# Altium project TX_Board.PrjPcb (part 2 of 5)
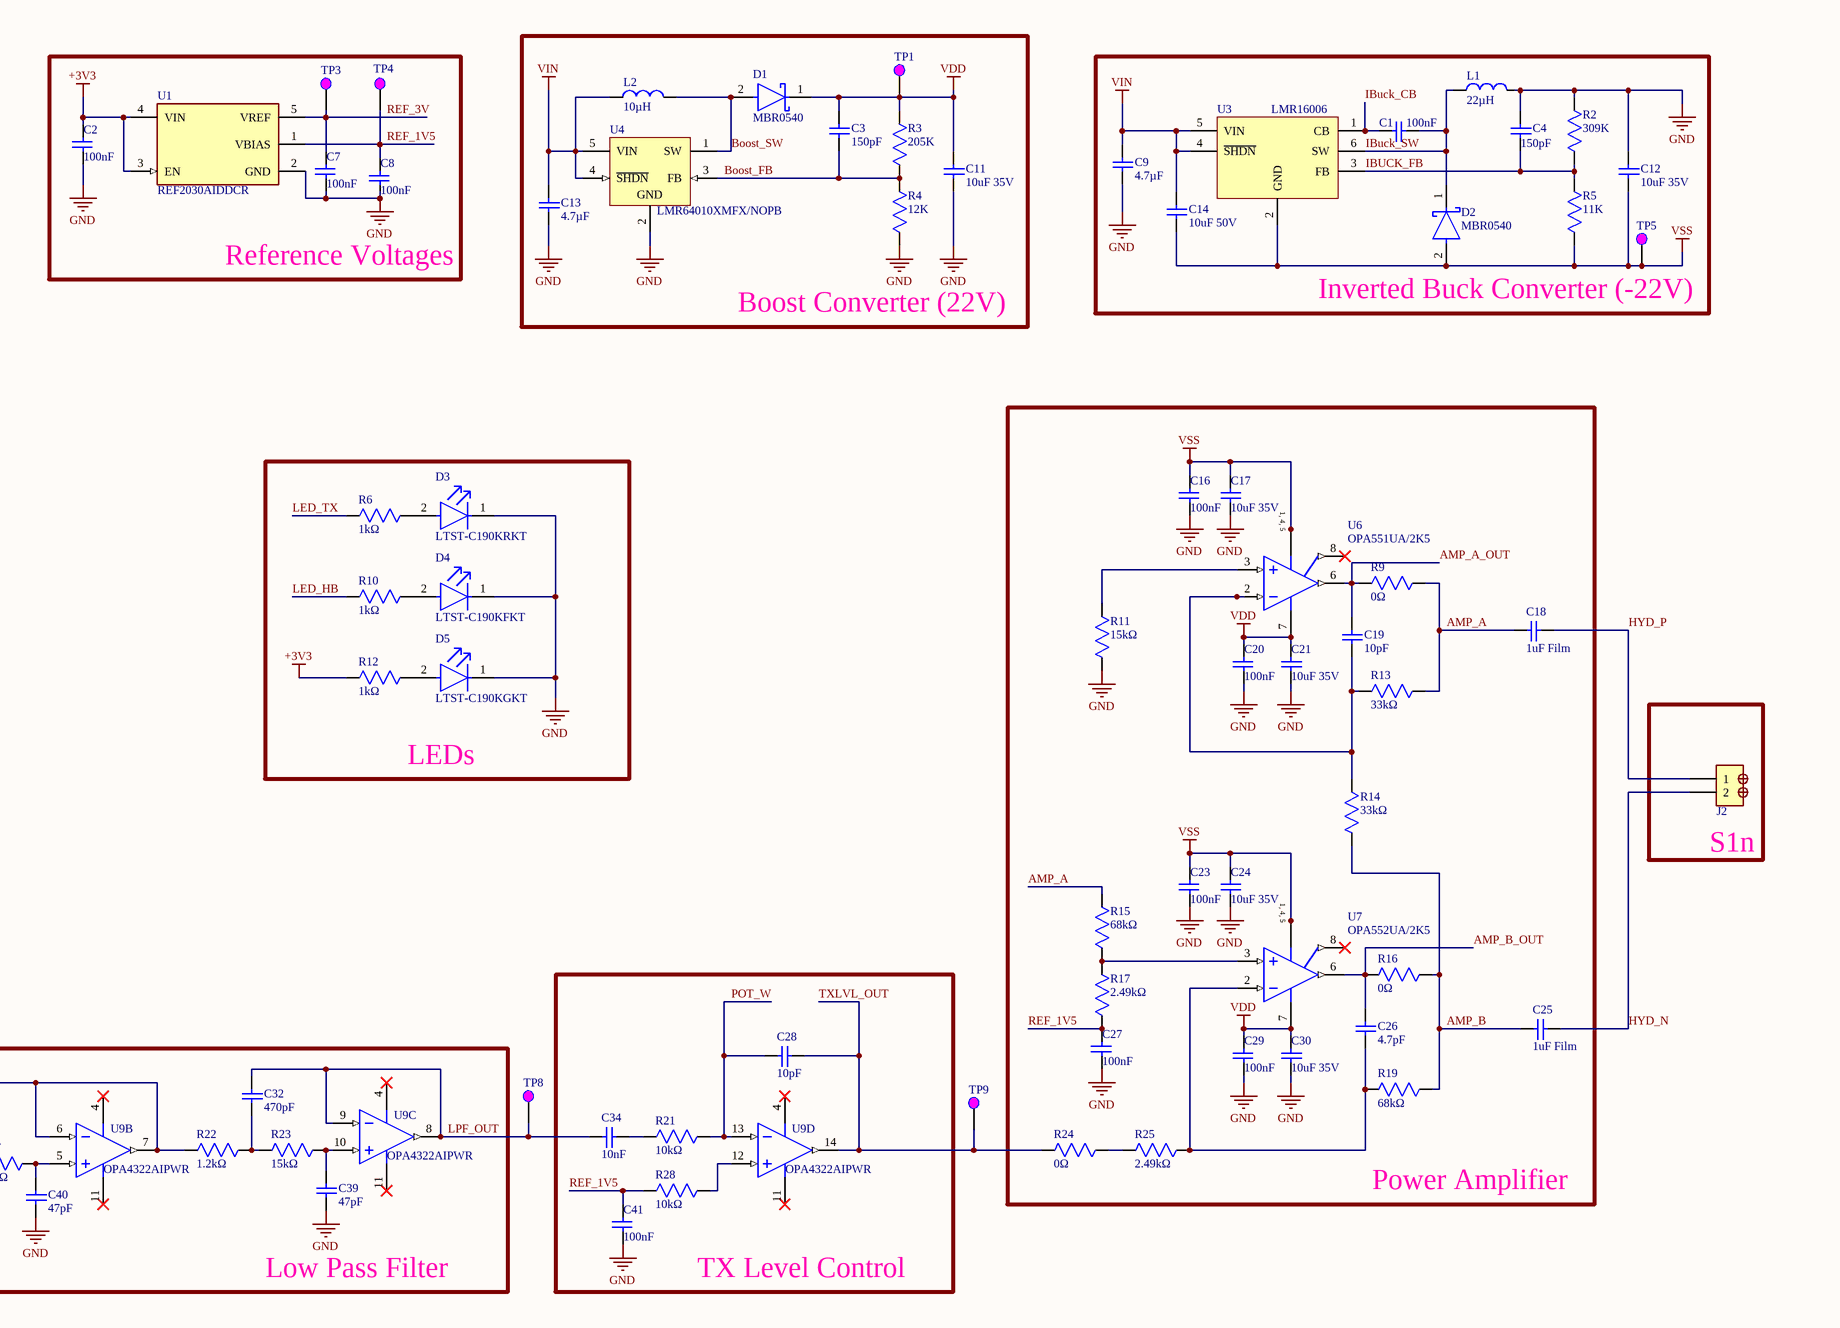
[diagram p2: TX_Board.SchDoc, right]

## Sheet TX_Board.SchDoc (continued)
### Library data of the parts
C1 C2 C6-C8 C15 C16 C20 C23 C27 C29 C31 C35 C38 C41 = CC0603KRX7R9BB104: Multilayer Ceramic Capacitor, CC Series, 0.1 - F, - 10%, X7R, 50 V, 0603 [1608 Metric]; Manufacturer: Yageo Group; Voltage: 50V; Supplier: Avnet; Supplier Part Number: CC0603KRX7R9BB104; Manufacturer Part Number: CC0603KRX7R9BB104; RoHS: Compliant; Category: Ceramic Capacitors; Stock: 6088000; Pricing: 4000=0.00582, 8000=0.00559, 16000=0.00541, 32000=0.00522, 64000=0.00504 (USD); Value: 100nF; Case/Package: 0603; Case Code (Imperial): 0603; Case Code (Metric): 1608; China RoHS: Compliant; Country of Origin: Mainland China, Taiwan; Depth: 800µm; Dielectric: X7R; Dielectric Material: Ceramic; Export Control Classification Number (ECCN) Code: EAR99; Halogen Free: Halogen Free; Height: 800µm; Harmonized Tariff Schedule (HTS) Code: 8532.24.00.20; Introduction Date: 2005-08-18; Lead Free: Lead Free; Length: 1.6mm; Lifecycle Status: Production; Material: Ceramic; Max Operating Temperature: 125°C; Min Operating Temperature: -55°C; Mounting Technology: Surface Mount; Pins: 2; Number of Terminals: 2; Radiation Hardening: No; REACH SVHC: Yes; Schedule B: 8532240020, 8532240020|8532240020, 8532240020|8532240020|8532240020, 8532240020|8532240020|8532240020|8532240020; Termination: SMD/SMT; Thickness: 889µm; Tolerance: 10%; Voltage Rating: 50V; Voltage Rating (DC): 50V; Width: 800µm; ComponentLink1URL: https://datasheet.octopart.com:443/CC0603KRX7R9BB104-Yageo-datasheet-177165144.pdf?src-supplier=IHS; ComponentLink1Description: https://datasheet.octopart.com:443/CC0603KRX7R9BB104-Yageo-datasheet-177165144.pdf?src-supplier=IHS; ComponentLink2URL: https://datasheet.octopart.com:443/CC0603KRX7R9BB104-Yageo-datasheet-82288757.pdf?src-supplier=Upverter; ComponentLink2Description: https://datasheet.octopart.com:443/CC0603KRX7R9BB104-Yageo-datasheet-82288757.pdf?src-supplier=Upverter; ComponentLink3URL: https://datasheet.octopart.com:443/CC0603KRX7R9BB104-Yageo-datasheet-68298032.pdf?src-supplier=Upverter; ComponentLink3Description: https://datasheet.octopart.com:443/CC0603KRX7R9BB104-Yageo-datasheet-68298032.pdf?src-supplier=Upverter; ComponentLink4URL: https://datasheet.octopart.com:443/CC0603KRX7R9BB104-Yageo-Group-datasheet-189192896.pdf?src-supplier=Future+Electronics; ComponentLink4Description: https://datasheet.octopart.com:443/CC0603KRX7R9BB104-Yageo-Group-datasheet-189192896.pdf?src-supplier=Future+Electronics; ComponentLink5URL: https://datasheet.octopart.com:443/CC0603KRX7R9BB104-Yageo-datasheet-12526321.pdf?src-supplier=Future+Electronics; ComponentLink5Description: https://datasheet.octopart.com:443/CC0603KRX7R9BB104-Yageo-datasheet-12526321.pdf?src-supplier=Future+Electronics; ComponentLink6URL: https://datasheet.octopart.com:443/CC0603KRX7R9BB104-Yageo-datasheet-166511530.pdf?src-supplier=Future+Electronics; ComponentLink6Description: https://datasheet.octopart.com:443/CC0603KRX7R9BB104-Yageo-datasheet-166511530.pdf?src-supplier=Future+Electronics; ComponentLink7URL: https://datasheet.octopart.com:443/CC0603KRX7R9BB104-Yageo-datasheet-137700082.pdf?src-supplier=Future+Electronics; ComponentLink7Description: https://datasheet.octopart.com:443/CC0603KRX7R9BB104-Yageo-datasheet-137700082.pdf?src-supplier=Future+Electronics; ComponentLink8URL: https://datasheet.octopart.com:443/CC0603KRX7R9BB104-Yageo-datasheet-137700084.pdf?src-supplier=Future+Electronics; ComponentLink8Description: https://datasheet.octopart.com:443/CC0603KRX7R9BB104-Yageo-datasheet-137700084.pdf?src-supplier=Future+Electronics; ComponentLink9URL: https://datasheet.octopart.com:443/CC0603KRX7R9BB104-Yageo-datasheet-27626582.pdf?src-supplier=Future+Electronics; ComponentLink9Description: https://datasheet.octopart.com:443/CC0603KRX7R9BB104-Yageo-datasheet-27626582.pdf?src-supplier=Future+Electronics; ComponentLink10URL: https://datasheet.octopart.com:443/CC0603KRX7R9BB104-Yageo-datasheet-15895757.pdf?src-supplier=Future+Electronics; ComponentLink10Description: https://datasheet.octopart.com:443/CC0603KRX7R9BB104-Yageo-datasheet-15895757.pdf?src-supplier=Future+Electronics; ComponentLink11URL: https://datasheet.octopart.com:443/CC0603KRX7R9BB104-Yageo-datasheet-8324192.pdf?src-supplier=Future+Electronics; ComponentLink11Description: https://datasheet.octopart.com:443/CC0603KRX7R9BB104-Yageo-datasheet-8324192.pdf?src-supplier=Future+Electronics; ComponentLink12URL: https://datasheet.octopart.com/CC0603KRX7R9BB104-Yageo-datasheet-10883670.pdf; ComponentLink12Description: https://datasheet.octopart.com/CC0603KRX7R9BB104-Yageo-datasheet-10883670.pdf; ComponentLink13URL: https://datasheet.octopart.com:443/CC0603KRX7R9BB104-Yageo-datasheet-181968726.pdf?src-supplier=Newark; ComponentLink13Description: https://datasheet.octopart.com:443/CC0603KRX7R9BB104-Yageo-datasheet-181968726.pdf?src-supplier=Newark; ComponentLink14URL: https://datasheet.octopart.com:443/CC0603KRX7R9BB104-Yageo-datasheet-499490.pdf?src-supplier=Newark; ComponentLink14Description: https://datasheet.octopart.com:443/CC0603KRX7R9BB104-Yageo-datasheet-499490.pdf?src-supplier=Newark; ComponentLink15URL: https://datasheet.octopart.com:443/CC0603KRX7R9BB104-Yageo-datasheet-62336348.pdf?src-supplier=Newark; ComponentLink15Description: https://datasheet.octopart.com:443/CC0603KRX7R9BB104-Yageo-datasheet-62336348.pdf?src-supplier=Newark; ComponentLink16URL: https://datasheet.octopart.com:443/CC0603KRX7R9BB104-Yageo-datasheet-147453679.pdf?src-supplier=Newark; ComponentLink16Description: https://datasheet.octopart.com:443/CC0603KRX7R9BB104-Yageo-datasheet-147453679.pdf?src-supplier=Newark; ComponentLink17URL: https://datasheet.octopart.com:443/CC0603KRX7R9BB104-Yageo-datasheet-151948686.pdf?src-supplier=Farnell; ComponentLink17Description: https://datasheet.octopart.com:443/CC0603KRX7R9BB104-Yageo-datasheet-151948686.pdf?src-supplier=Farnell; ComponentLink18URL: https://datasheet.octopart.com:443/CC0603KRX7R9BB104-Yageo-datasheet-500777.pdf?src-supplier=Farnell; ComponentLink18Description: https://datasheet.octopart.com:443/CC0603KRX7R9BB104-Yageo-datasheet-500777.pdf?src-supplier=Farnell; ComponentLink19URL: https://datasheet.octopart.com:443/CC0603KRX7R9BB104-Yageo-datasheet-178019014.pdf?src-supplier=Burklin+Elektronik; ComponentLink19Description: https://datasheet.octopart.com:443/CC0603KRX7R9BB104-Yageo-datasheet-178019014.pdf?src-supplier=Burklin+Elektronik; ComponentLink20URL: https://datasheet.octopart.com:443/CC0603KRX7R9BB104-Yageo-Group-datasheet-165992755.pdf?src-supplier=ODG+(Origin+Data+Global); ComponentLink20Description: https://datasheet.octopart.com:443/CC0603KRX7R9BB104-Yageo-Group-datasheet-165992755.pdf?src-supplier=ODG+(Origin+Data+Global); ComponentLink21URL: https://datasheet.octopart.com:443/CC0603KRX7R9BB104-Yageo-datasheet-140260305.pdf?src-supplier=SOS+electronic; ComponentLink21Description: https://datasheet.octopart.com:443/CC0603KRX7R9BB104-Yageo-datasheet-140260305.pdf?src-supplier=SOS+electronic; ComponentLink22URL: https://datasheet.octopart.com:443/CC0603KRX7R9BB104-Yageo-datasheet-120101875.pdf?src-supplier=Megastar; ComponentLink22Description: https://datasheet.octopart.com:443/CC0603KRX7R9BB104-Yageo-datasheet-120101875.pdf?src-supplier=Megastar; ComponentLink23URL: https://datasheet.octopart.com:443/CC0603KRX7R9BB104-Yageo-datasheet-8701427.pdf?src-supplier=element14; ComponentLink23Description: https://datasheet.octopart.com:443/CC0603KRX7R9BB104-Yageo-datasheet-8701427.pdf?src-supplier=element14; ComponentLink24URL: https://datasheet.octopart.com:443/CC0603KRX7R9BB104-Yageo-datasheet-5301394.pdf?src-supplier=element14; ComponentLink24Description: https://datasheet.octopart.com:443/CC0603KRX7R9BB104-Yageo-datasheet-5301394.pdf?src-supplier=element14; ComponentLink25URL: https://datasheet.octopart.com:443/CC0603KRX7R9BB104-Yageo-datasheet-17600895.pdf?src-supplier=TME; ComponentLink25Description: https://datasheet.octopart.com:443/CC0603KRX7R9BB104-Yageo-datasheet-17600895.pdf?src-supplier=TME; ComponentLink26URL: http://sigma.octopart.com:80/15889575/rohs_statement/Yageo-CC0603KRX7R9BB104.pdf?src-supplier=Compliance+Statements; ComponentLink26Description: http://sigma.octopart.com:80/15889575/rohs_statement/Yageo-CC0603KRX7R9BB104.pdf?src-supplier=Compliance+Statements; ComponentLink27URL: http://sigma.octopart.com:80/conflict_mineral_statement/Yageo-company-3.pdf?src-supplier=Compliance+Statements; ComponentLink27Description: http://sigma.octopart.com:80/conflict_mineral_statement/Yageo-company-3.pdf?src-supplier=Compliance+Statements; JLCPCB Part Number: C14663
C3 C4 = CC0603JRNPO9BN151: Surface Mount Ceramic Multilayer Capacitor 150pF 5% C0G 50V 0603 Paper T/R; Manufacturer: Yageo Group; Insulation Resistance: 100GΩ; Temperature Coefficient: 30ppm/°C; Supplier: Avnet; Supplier Part Number: CC0603JRNPO9BN151; Manufacturer Part Number: CC0603JRNPO9BN151; RoHS: Compliant; Category: Ceramic Capacitors; Stock: 168000; Pricing: 4000=0.00694 (USD); Value: 150pF; Case/Package: 0603; Case Code (Imperial): 0603; Case Code (Metric): 1608; China RoHS: Compliant; Composition: Ceramic; Country of Origin: Mainland China, Taiwan; Depth: 800µm; Dielectric: C0G; Dielectric Material: Ceramic; Export Control Classification Number (ECCN) Code: EAR99; Halogen Free: Halogen Free; Height: 800µm; Harmonized Tariff Schedule (HTS) Code: 8532.24.00.20; Introduction Date: 2005-07-07; Lead Free: Lead Free; Length: 1.6mm; Lifecycle Status: Production; Material: Ceramic; Max Operating Temperature: 125°C; Min Operating Temperature: -55°C; Mounting Technology: Surface Mount; Pins: 2; Number of Terminals: 2; Radiation Hardening: No; REACH SVHC: Unaffected; Termination: SMD/SMT; Thickness: 889µm; Tolerance: 5%; Voltage: 50V; Voltage Rating: 50V; Voltage Rating (AC): 50V; Voltage Rating (DC): 50V; Width: 800µm; ComponentLink1URL: https://datasheet.octopart.com:443/CC0603JRNPO9BN151-Yageo-datasheet-182140217.pdf?src-supplier=IHS; ComponentLink1Description: https://datasheet.octopart.com:443/CC0603JRNPO9BN151-Yageo-datasheet-182140217.pdf?src-supplier=IHS; ComponentLink2URL: https://datasheet.octopart.com:443/CC0603JRNPO9BN151-Yageo-datasheet-10406438.pdf?src-supplier=element14+APAC; ComponentLink2Description: https://datasheet.octopart.com:443/CC0603JRNPO9BN151-Yageo-datasheet-10406438.pdf?src-supplier=element14+APAC; ComponentLink3URL: https://datasheet.octopart.com:443/CC0603JRNPO9BN151-Yageo-datasheet-65873193.pdf?src-supplier=element14+APAC; ComponentLink3Description: https://datasheet.octopart.com:443/CC0603JRNPO9BN151-Yageo-datasheet-65873193.pdf?src-supplier=element14+APAC; ComponentLink4URL: https://datasheet.octopart.com:443/CC0603JRNPO9BN151-Yageo-datasheet-10882999.pdf?src-supplier=element14+APAC; ComponentLink4Description: https://datasheet.octopart.com:443/CC0603JRNPO9BN151-Yageo-datasheet-10882999.pdf?src-supplier=element14+APAC; ComponentLink5URL: https://datasheet.octopart.com:443/CC0603JRNPO9BN151-Yageo-datasheet-5321569.pdf?src-supplier=Newark; ComponentLink5Description: https://datasheet.octopart.com:443/CC0603JRNPO9BN151-Yageo-datasheet-5321569.pdf?src-supplier=Newark; ComponentLink6URL: https://datasheet.octopart.com:443/CC0603JRNPO9BN151-Yageo-datasheet-181968183.pdf?src-supplier=Newark; ComponentLink6Description: https://datasheet.octopart.com:443/CC0603JRNPO9BN151-Yageo-datasheet-181968183.pdf?src-supplier=Newark; ComponentLink7URL: https://datasheet.octopart.com:443/CC0603JRNPO9BN151-Yageo-datasheet-181968182.pdf?src-supplier=Newark; ComponentLink7Description: https://datasheet.octopart.com:443/CC0603JRNPO9BN151-Yageo-datasheet-181968182.pdf?src-supplier=Newark; ComponentLink8URL: https://datasheet.octopart.com:443/CC0603JRNPO9BN151-Yageo-datasheet-151948684.pdf?src-supplier=Newark; ComponentLink8Description: https://datasheet.octopart.com:443/CC0603JRNPO9BN151-Yageo-datasheet-151948684.pdf?src-supplier=Newark; ComponentLink9URL: https://datasheet.octopart.com:443/CC0603JRNPO9BN151-Yageo-datasheet-67645495.pdf?src-supplier=Newark; ComponentLink9Description: https://datasheet.octopart.com:443/CC0603JRNPO9BN151-Yageo-datasheet-67645495.pdf?src-supplier=Newark; ComponentLink10URL: https://datasheet.octopart.com:443/CC0603JRNPO9BN151-Yageo-datasheet-137875056.pdf?src-supplier=Future+Electronics; ComponentLink10Description: https://datasheet.octopart.com:443/CC0603JRNPO9BN151-Yageo-datasheet-137875056.pdf?src-supplier=Future+Electronics; ComponentLink11URL: https://datasheet.octopart.com:443/CC0603JRNPO9BN151-Yageo-datasheet-136957424.pdf?src-supplier=Future+Electronics; ComponentLink11Description: https://datasheet.octopart.com:443/CC0603JRNPO9BN151-Yageo-datasheet-136957424.pdf?src-supplier=Future+Electronics; ComponentLink12URL: https://datasheet.octopart.com:443/CC0603JRNPO9BN151-Yageo-datasheet-137700082.pdf?src-supplier=Future+Electronics; ComponentLink12Description: https://datasheet.octopart.com:443/CC0603JRNPO9BN151-Yageo-datasheet-137700082.pdf?src-supplier=Future+Electronics; ComponentLink13URL: https://datasheet.octopart.com:443/CC0603JRNPO9BN151-Yageo-datasheet-78855684.pdf?src-supplier=Future+Electronics; ComponentLink13Description: https://datasheet.octopart.com:443/CC0603JRNPO9BN151-Yageo-datasheet-78855684.pdf?src-supplier=Future+Electronics; ComponentLink14URL: https://datasheet.octopart.com:443/CC0603JRNPO9BN151-Yageo-datasheet-62091628.pdf?src-supplier=Future+Electronics; ComponentLink14Description: https://datasheet.octopart.com:443/CC0603JRNPO9BN151-Yageo-datasheet-62091628.pdf?src-supplier=Future+Electronics; ComponentLink15URL: https://datasheet.octopart.com:443/CC0603JRNPO9BN151-Yageo-datasheet-24578986.pdf?src-supplier=Future+Electronics; ComponentLink15Description: https://datasheet.octopart.com:443/CC0603JRNPO9BN151-Yageo-datasheet-24578986.pdf?src-supplier=Future+Electronics; ComponentLink16URL: https://datasheet.octopart.com:443/CC0603JRNPO9BN151-Yageo-datasheet-16730043.pdf?src-supplier=Future+Electronics; ComponentLink16Description: https://datasheet.octopart.com:443/CC0603JRNPO9BN151-Yageo-datasheet-16730043.pdf?src-supplier=Future+Electronics; ComponentLink17URL: https://datasheet.octopart.com:443/CC0603JRNPO9BN151-Yageo-datasheet-15895757.pdf?src-supplier=Future+Electronics; ComponentLink17Description: https://datasheet.octopart.com:443/CC0603JRNPO9BN151-Yageo-datasheet-15895757.pdf?src-supplier=Future+Electronics; ComponentLink18URL: https://datasheet.octopart.com:443/CC0603JRNPO9BN151-Yageo-datasheet-12589826.pdf?src-supplier=Future+Electronics; ComponentLink18Description: https://datasheet.octopart.com:443/CC0603JRNPO9BN151-Yageo-datasheet-12589826.pdf?src-supplier=Future+Electronics; ComponentLink19URL: https://datasheet.octopart.com:443/CC0603JRNPO9BN151-Yageo-datasheet-8817079.pdf?src-supplier=element14; ComponentLink19Description: https://datasheet.octopart.com:443/CC0603JRNPO9BN151-Yageo-datasheet-8817079.pdf?src-supplier=element14; ComponentLink20URL: https://datasheet.octopart.com:443/CC0603JRNPO9BN151-Yageo-datasheet-8324240.pdf?src-supplier=element14; ComponentLink20Description: https://datasheet.octopart.com:443/CC0603JRNPO9BN151-Yageo-datasheet-8324240.pdf?src-supplier=element14; ComponentLink21URL: https://datasheet.octopart.com:443/CC0603JRNPO9BN151-Yageo-datasheet-504625.pdf?src-supplier=element14; ComponentLink21Description: https://datasheet.octopart.com:443/CC0603JRNPO9BN151-Yageo-datasheet-504625.pdf?src-supplier=element14; ComponentLink22URL: https://datasheet.octopart.com:443/CC0603JRNPO9BN151-Yageo-Group-datasheet-188129580.pdf?src-supplier=LCSC; ComponentLink22Description: https://datasheet.octopart.com:443/CC0603JRNPO9BN151-Yageo-Group-datasheet-188129580.pdf?src-supplier=LCSC; ComponentLink23URL: https://datasheet.octopart.com:443/CC0603JRNPO9BN151-Yageo-datasheet-10621397.pdf?src-supplier=Farnell; ComponentLink23Description: https://datasheet.octopart.com:443/CC0603JRNPO9BN151-Yageo-datasheet-10621397.pdf?src-supplier=Farnell; ComponentLink24URL: https://datasheet.octopart.com:443/CC0603JRNPO9BN151-Yageo-datasheet-8643175.pdf?src-supplier=SOS+electronic; ComponentLink24Description: https://datasheet.octopart.com:443/CC0603JRNPO9BN151-Yageo-datasheet-8643175.pdf?src-supplier=SOS+electronic; ComponentLink25URL: https://datasheet.octopart.com:443/CC0603JRNPO9BN151-Yageo-datasheet-68296204.pdf?src-supplier=Megastar; ComponentLink25Description: https://datasheet.octopart.com:443/CC0603JRNPO9BN151-Yageo-datasheet-68296204.pdf?src-supplier=Megastar; ComponentLink26URL: http://sigma.octopart.com:80/conflict_mineral_statement/Yageo-company-3.pdf?src-supplier=Compliance+Statements; ComponentLink26Description: http://sigma.octopart.com:80/conflict_mineral_statement/Yageo-company-3.pdf?src-supplier=Compliance+Statements; ComponentLink27URL: http://sigma.octopart.com:80/rohs_statement/Yageo-company-2.pdf?src-supplier=Compliance+Statements; ComponentLink27Description: http://sigma.octopart.com:80/rohs_statement/Yageo-company-2.pdf?src-supplier=Compliance+Statements; JLCPCB Part Number: C107038
C5 C37 = CL10A106MA8NRNC: 25V 10uF X5R ±20% 0603 Multilayer Ceramic Capacitors MLCC - SMD/SMT ROHS; Manufacturer: Samsung Electro-Mechanics; Value: 10µF; Supplier: Avnet; Supplier Part Number: CL10A106MA8NRNC; Manufacturer Part Number: CL10A106MA8NRNC; RoHS: Compliant; Category: Ceramic Capacitors; Stock: 6860000; Pricing: 4000=0.03585, 8000=0.03513, 16000=0.03443, 32000=0.03377, 64000=0.03313 (USD); Case/Package: 0603; Case Code (Imperial): 0603; Case Code (Metric): 1608; China RoHS: Compliant; Contact Plating: Tin; Country of Origin: Mainland China, Philippines, South Korea; Dielectric: X5R; Dielectric Material: Ceramic; Export Control Classification Number (ECCN) Code: EAR99; Height: 800µm; Harmonized Tariff Schedule (HTS) Code: 8532.24.00.20; Introduction Date: 2013-01-16; Lead Free: Lead Free; Length: 1.6mm; Lifecycle Status: Production; Material: Ceramic; Max Operating Temperature: 85°C; Min Operating Temperature: -55°C; Mounting Technology: Surface Mount; Number of Terminals: 2; Packaging: Tape & Reel (TR); REACH SVHC: Yes; Schedule B: 8532240020, 8532240020|8532240020|8532240020|8532240020|8532240020|8532240020|8532240020|8532240020|8532240020|8532240020|8532240020, 8532240020|8532240020|8532240020|8532240020|8532240020|8532240020|8532240020|8532240020|8532240020|8532240020|8532240020|8532240020, 8532240020|8532240020|8532240020|8532240020|8532240020|8532240020|8532240020|8532240020|8532240020|8532240020|8532240020|8532240020|8532240020; Termination: Wraparound; Thickness: 889µm; Tolerance: 20%; Voltage Rating: 25V; Voltage Rating (DC): 25V; Width: 800µm; ComponentLink1URL: https://datasheet.octopart.com:443/CL10A106MA8NRNC-Samsung-Electro-Mechanics-datasheet-182019172.pdf?src-supplier=IHS; ComponentLink1Description: https://datasheet.octopart.com:443/CL10A106MA8NRNC-Samsung-Electro-Mechanics-datasheet-182019172.pdf?src-supplier=IHS; ComponentLink2URL: https://datasheet.octopart.com:443/CL10A106MA8NRNC-Samsung-Electro-Mechanics-datasheet-137745063.pdf?src-supplier=Future+Electronics; ComponentLink2Description: https://datasheet.octopart.com:443/CL10A106MA8NRNC-Samsung-Electro-Mechanics-datasheet-137745063.pdf?src-supplier=Future+Electronics; ComponentLink3URL: https://datasheet.octopart.com:443/CL10A106MA8NRNC-Samsung-Electro-Mechanics-datasheet-136031756.pdf?src-supplier=Future+Electronics; ComponentLink3Description: https://datasheet.octopart.com:443/CL10A106MA8NRNC-Samsung-Electro-Mechanics-datasheet-136031756.pdf?src-supplier=Future+Electronics; ComponentLink4URL: https://datasheet.octopart.com:443/CL10A106MA8NRNC-Samsung-Electro-Mechanics-datasheet-110226291.pdf?src-supplier=Future+Electronics; ComponentLink4Description: https://datasheet.octopart.com:443/CL10A106MA8NRNC-Samsung-Electro-Mechanics-datasheet-110226291.pdf?src-supplier=Future+Electronics; ComponentLink5URL: https://datasheet.octopart.com:443/CL10A106MA8NRNC-Samsung-Electro-Mechanics-datasheet-87580073.pdf?src-supplier=Future+Electronics; ComponentLink5Description: https://datasheet.octopart.com:443/CL10A106MA8NRNC-Samsung-Electro-Mechanics-datasheet-87580073.pdf?src-supplier=Future+Electronics; ComponentLink6URL: https://datasheet.octopart.com:443/CL10A106MA8NRNC-Samsung-Electro-Mechanics-datasheet-68300265.pdf?src-supplier=Future+Electronics; ComponentLink6Description: https://datasheet.octopart.com:443/CL10A106MA8NRNC-Samsung-Electro-Mechanics-datasheet-68300265.pdf?src-supplier=Future+Electronics; ComponentLink7URL: https://datasheet.octopart.com:443/CL10A106MA8NRNC-Samsung-datasheet-66660282.pdf?src-supplier=Future+Electronics; ComponentLink7Description: https://datasheet.octopart.com:443/CL10A106MA8NRNC-Samsung-datasheet-66660282.pdf?src-supplier=Future+Electronics; ComponentLink8URL: https://datasheet.octopart.com:443/CL10A106MA8NRNC-Samsung-datasheet-48647236.pdf?src-supplier=Future+Electronics; ComponentLink8Description: https://datasheet.octopart.com:443/CL10A106MA8NRNC-Samsung-datasheet-48647236.pdf?src-supplier=Future+Electronics; ComponentLink9URL: https://datasheet.octopart.com:443/CL10A106MA8NRNC-Samsung-datasheet-39118733.pdf?src-supplier=Future+Electronics; ComponentLink9Description: https://datasheet.octopart.com:443/CL10A106MA8NRNC-Samsung-datasheet-39118733.pdf?src-supplier=Future+Electronics; ComponentLink10URL: https://datasheet.octopart.com:443/CL10A106MA8NRNC-Samsung-Electro-Mechanics-datasheet-149156483.pdf?src-supplier=Future+Electronics; ComponentLink10Description: https://datasheet.octopart.com:443/CL10A106MA8NRNC-Samsung-Electro-Mechanics-datasheet-149156483.pdf?src-supplier=Future+Electronics; JLCPCB Part Number: C96446
C9 C13 C36 = CL10A475KA8NQNC: 25V 4.7uF X5R 卤10% 0603 Multilayer Ceramic Capacitors MLCC - SMD/SMT ROHS; Manufacturer: Samsung Electro-Mechanics; Tolerance: 10%; Supplier: Future Electronics; Supplier Part Number: CL10A475KA8NQNC; Manufacturer Part Number: CL10A475KA8NQNC; RoHS: Compliant; Category: Ceramic Capacitors; Stock: 708000; Pricing: 4000=0.365 (USD); Value: 4.7µF; Case/Package: 0603; Case Code (Imperial): 0603; Case Code (Metric): 1608; China RoHS: Compliant; Contact Plating: Tin; Country of Origin: Mainland China, Philippines, South Korea; Depth: 800µm; Dielectric: X5R; Dielectric Material: Ceramic; Export Control Classification Number (ECCN) Code: EAR99; Height: 950µm; Harmonized Tariff Schedule (HTS) Code: 8532.24.00.20; Introduction Date: 2010-04-05; Lead Free: Lead Free; Length: 1.6mm; Lifecycle Status: Production; Material: Ceramic; Max Operating Temperature: 85°C; Min Operating Temperature: -55°C; Mounting Technology: Surface Mount; Number of Terminals: 2; Packaging: Tape & Reel (TR); REACH SVHC: Unaffected; Schedule B: 8532240020, 8532240020|8532240020, 8532240020|8532240020|8532240020, 8532240020|8532240020|8532240020|8532240020; Termination: Wraparound; Thickness: 889µm; Voltage Rating: 25V; Voltage Rating (DC): 25V; Width: 800µm; ComponentLink1URL: https://datasheet.octopart.com:443/CL10A475KA8NQNC-Samsung-Electro-Mechanics-datasheet-182019420.pdf?src-supplier=IHS; ComponentLink1Description: https://datasheet.octopart.com:443/CL10A475KA8NQNC-Samsung-Electro-Mechanics-datasheet-182019420.pdf?src-supplier=IHS; ComponentLink2URL: https://datasheet.octopart.com:443/CL10A475KA8NQNC-Samsung-Electro-Mechanics-datasheet-136031786.pdf?src-supplier=Samsung+SCT; ComponentLink2Description: https://datasheet.octopart.com:443/CL10A475KA8NQNC-Samsung-Electro-Mechanics-datasheet-136031786.pdf?src-supplier=Samsung+SCT; ComponentLink3URL: https://datasheet.octopart.com:443/CL10A475KA8NQNC-Samsung-Electro-Mechanics-datasheet-133510619.pdf?src-supplier=Future+Electronics; ComponentLink3Description: https://datasheet.octopart.com:443/CL10A475KA8NQNC-Samsung-Electro-Mechanics-datasheet-133510619.pdf?src-supplier=Future+Electronics; ComponentLink4URL: https://datasheet.octopart.com:443/CL10A475KA8NQNC-Samsung-Electro-Mechanics-datasheet-68304637.pdf?src-supplier=Future+Electronics; ComponentLink4Description: https://datasheet.octopart.com:443/CL10A475KA8NQNC-Samsung-Electro-Mechanics-datasheet-68304637.pdf?src-supplier=Future+Electronics; ComponentLink5URL: https://datasheet.octopart.com:443/CL10A475KA8NQNC-Samsung-datasheet-66660282.pdf?src-supplier=Future+Electronics; ComponentLink5Description: https://datasheet.octopart.com:443/CL10A475KA8NQNC-Samsung-datasheet-66660282.pdf?src-supplier=Future+Electronics; ComponentLink6URL: https://datasheet.octopart.com:443/CL10A475KA8NQNC-Samsung-datasheet-42901174.pdf?src-supplier=Future+Electronics; ComponentLink6Description: https://datasheet.octopart.com:443/CL10A475KA8NQNC-Samsung-datasheet-42901174.pdf?src-supplier=Future+Electronics; ComponentLink7URL: https://datasheet.octopart.com:443/CL10A475KA8NQNC-Samsung-Electro-Mechanics-datasheet-100454038.pdf?src-supplier=Future+Electronics; ComponentLink7Description: https://datasheet.octopart.com:443/CL10A475KA8NQNC-Samsung-Electro-Mechanics-datasheet-100454038.pdf?src-supplier=Future+Electronics; ComponentLink8URL: https://datasheet.octopart.com:443/CL10A475KA8NQNC-Samsung-Electro-Mechanics-datasheet-149158805.pdf?src-supplier=Future+Electronics; ComponentLink8Description: https://datasheet.octopart.com:443/CL10A475KA8NQNC-Samsung-Electro-Mechanics-datasheet-149158805.pdf?src-supplier=Future+Electronics; JLCPCB Part Number: C69335
C10 = CL10B105KB8NQNC: MLCC - 0603 50 V X7R 1 uF 10 % Multilayer Ceramic Capacitor; Manufacturer: Samsung Electro-Mechanics; Tolerance: 10%; Voltage Rating (DC): 50V; Supplier: Future Electronics; Supplier Part Number: CL10B105KB8NQNC; Manufacturer Part Number: CL10B105KB8NQNC; RoHS: Compliant; Category: Ceramic Capacitors; Stock: 52000; Pricing: 4000=0.0293, 8000=0.0289, 16000=0.0284, 20000=0.0283, 60000=0.0274 (USD); Value: 1µF; Case/Package: 0603; China RoHS: Compliant; Dielectric Material: Ceramic; Height: 800µm; Length: 1.6mm; Lifecycle Status: Production; Max Operating Temperature: 125°C; Min Operating Temperature: -55°C; Mounting Technology: Surface Mount; Number of Terminals: 2; REACH SVHC: Unaffected; Width: 800µm; ComponentLink1URL: https://datasheet.octopart.com:443/CL10B105KB8NQNC-Samsung-Electro-Mechanics-datasheet-182019892.pdf?src-supplier=IHS; ComponentLink1Description: https://datasheet.octopart.com:443/CL10B105KB8NQNC-Samsung-Electro-Mechanics-datasheet-182019892.pdf?src-supplier=IHS; ComponentLink2URL: https://datasheet.octopart.com:443/CL10B105KB8NQNC-Samsung-datasheet-8326407.pdf?src-supplier=TME; ComponentLink2Description: https://datasheet.octopart.com:443/CL10B105KB8NQNC-Samsung-datasheet-8326407.pdf?src-supplier=TME; ComponentLink3URL: https://datasheet.octopart.com:443/CL10B105KB8NQNC-Samsung-Electro-Mechanics-datasheet-168551976.pdf?src-supplier=Future+Electronics; ComponentLink3Description: https://datasheet.octopart.com:443/CL10B105KB8NQNC-Samsung-Electro-Mechanics-datasheet-168551976.pdf?src-supplier=Future+Electronics; JLCPCB Part Number: C5199872
C11 C12 C17 C21 C24 C30 = GRM188R6YA106MA73D: 35V 10uF X5R ±20% 0603 Multilayer Ceramic Capacitors MLCC - SMD/SMT ROHS; Manufacturer: Murata; Manufacturer Lifecycle Status: IN PRODUCTION; Value: 10µF; Supplier: Future Electronics; Supplier Part Number: GRM188R6YA106MA73D; Manufacturer Part Number: GRM188R6YA106MA73D; RoHS: Compliant; Category: Ceramic Capacitors; Stock: 856000; Pricing: 4000=0.22 (USD); Case/Package: 0603; Case Code (Imperial): 0603; Case Code (Metric): 1608; Dielectric: X5R; Dielectric Material: Ceramic; Height: 800µm; Length: 1.6mm; Lifecycle Status: Production; Material: Ceramic; Max Operating Temperature: 85°C; Min Operating Temperature: -55°C; Mounting Technology: Surface Mount; Number of Terminals: 2; REACH SVHC: Unaffected; Schedule B: 8532240020, 8532240020|8532240020|8532240020|8532240020|8532240020|8532240020|8532240020|8532240020|8532240020|8532240020|8532240020|8532240020|8532240020|8532240020|8532240020|8532240020|8532240020|8532240020|8532240020|8532240020|8532240020|8532240020|8532240020|85; Thickness: 800µm; Tolerance: 20%; Voltage Rating: 35V; Voltage Rating (DC): 35V; Width: 800µm; ComponentLink1URL: https://datasheet.octopart.com:443/GRM188R6YA106MA73D-Murata-datasheet-149523261.pdf?src-supplier=Newark; ComponentLink1Description: https://datasheet.octopart.com:443/GRM188R6YA106MA73D-Murata-datasheet-149523261.pdf?src-supplier=Newark; ComponentLink2URL: https://datasheet.octopart.com:443/GRM188R6YA106MA73D-Murata-datasheet-165579666.pdf?src-supplier=TME; ComponentLink2Description: https://datasheet.octopart.com:443/GRM188R6YA106MA73D-Murata-datasheet-165579666.pdf?src-supplier=TME; ComponentLink3URL: https://datasheet.octopart.com:443/GRM188R6YA106MA73D-Murata-datasheet-141274968.pdf?src-supplier=Ciiva; ComponentLink3Description: https://datasheet.octopart.com:443/GRM188R6YA106MA73D-Murata-datasheet-141274968.pdf?src-supplier=Ciiva; ComponentLink4URL: https://datasheet.octopart.com:443/GRM188R6YA106MA73D-Murata-datasheet-140705172.pdf?src-supplier=Ciiva; ComponentLink4Description: https://datasheet.octopart.com:443/GRM188R6YA106MA73D-Murata-datasheet-140705172.pdf?src-supplier=Ciiva; ComponentLink5URL: https://datasheet.octopart.com:443/GRM188R6YA106MA73D-Murata-datasheet-138742920.pdf?src-supplier=Ciiva; ComponentLink5Description: https://datasheet.octopart.com:443/GRM188R6YA106MA73D-Murata-datasheet-138742920.pdf?src-supplier=Ciiva; ComponentLink6URL: https://datasheet.octopart.com:443/GRM188R6YA106MA73D-Murata-datasheet-86813743.pdf?src-supplier=Future+Electronics; ComponentLink6Description: https://datasheet.octopart.com:443/GRM188R6YA106MA73D-Murata-datasheet-86813743.pdf?src-supplier=Future+Electronics; ComponentLink7URL: https://datasheet.octopart.com/GRM188R6YA106MA73D-Murata-datasheet-12515295.pdf; ComponentLink7Description: https://datasheet.octopart.com/GRM188R6YA106MA73D-Murata-datasheet-12515295.pdf; ComponentLink8URL: https://datasheet.octopart.com/GRM188R6YA106MA73D-Murata-datasheet-12510076.pdf; ComponentLink8Description: https://datasheet.octopart.com/GRM188R6YA106MA73D-Murata-datasheet-12510076.pdf; ComponentLink9URL: https://datasheet.octopart.com/GRM188R6YA106MA73D-Murata-datasheet-11978611.pdf; ComponentLink9Description: https://datasheet.octopart.com/GRM188R6YA106MA73D-Murata-datasheet-11978611.pdf; ComponentLink10URL: https://datasheet.octopart.com/GRM188R6YA106MA73D-Murata-datasheet-10025737.pdf; ComponentLink10Description: https://datasheet.octopart.com/GRM188R6YA106MA73D-Murata-datasheet-10025737.pdf; ComponentLink11URL: https://datasheet.octopart.com/GRM188R6YA106MA73D-Murata-datasheet-8819587.pdf; ComponentLink11Description: https://datasheet.octopart.com/GRM188R6YA106MA73D-Murata-datasheet-8819587.pdf; ComponentLink12URL: http://sigma.octopart.com:80/reach_statement/Murata-company-16.pdf?src-supplier=Compliance+Statements; ComponentLink12Description: http://sigma.octopart.com:80/reach_statement/Murata-company-16.pdf?src-supplier=Compliance+Statements; JLCPCB Part Number: C194427
C14 = GRM21BR61H106KE43L: 50V 10uF X5R ±10% 0805 Multilayer Ceramic Capacitors MLCC - SMD/SMT ROHS; Manufacturer: Murata; Manufacturer Lifecycle Status: IN PRODUCTION; Value: 10µF; Supplier: Newark; Supplier Part Number: GRM21BR61H106KE43L; Manufacturer Part Number: GRM21BR61H106KE43L; RoHS: Compliant; Category: Ceramic Capacitors; Pricing: 1=0.319, 6=0.103, 25=0.142, 51=0.0916, 100=0.127, 250=0.115, 251=0.0713, 500=0.102, 501=0.0676, 1000=0.094, 2500=0.088, 5000=0.081 (USD); Case/Package: 0805; Country of Origin: Japan, Mainland China, Philippines, Singapore, Thailand; Dielectric: X5R; Dielectric Material: Ceramic; Export Control Classification Number (ECCN) Code: EAR99; Height: 1.25mm; Harmonized Tariff Schedule (HTS) Code: 8532.24.00.20; Introduction Date: 2018-09-13; Length: 2mm; Lifecycle Status: Production; Material: Ceramic; Max Operating Temperature: 85°C; Min Operating Temperature: -55°C; Mounting Technology: Surface Mount; Number of Terminals: 2; REACH SVHC: Unaffected; Thickness: 1.25mm; Tolerance: 10%; Voltage Rating: 50V; Voltage Rating (DC): 50V; Width: 1.25mm; ComponentLink1URL: https://datasheet.octopart.com:443/GRM21BR61H106KE43L-Murata-datasheet-155345082.pdf?src-supplier=Newark; ComponentLink1Description: https://datasheet.octopart.com:443/GRM21BR61H106KE43L-Murata-datasheet-155345082.pdf?src-supplier=Newark; ComponentLink2URL: https://datasheet.octopart.com:443/GRM21BR61H106KE43L-Murata-datasheet-141278272.pdf?src-supplier=Geoflip; ComponentLink2Description: https://datasheet.octopart.com:443/GRM21BR61H106KE43L-Murata-datasheet-141278272.pdf?src-supplier=Geoflip; ComponentLink3URL: https://datasheet.octopart.com:443/GRM21BR61H106KE43L-Murata-datasheet-165579666.pdf?src-supplier=TME; ComponentLink3Description: https://datasheet.octopart.com:443/GRM21BR61H106KE43L-Murata-datasheet-165579666.pdf?src-supplier=TME; ComponentLink4URL: https://datasheet.octopart.com:443/GRM21BR61H106KE43L-Murata-datasheet-140707579.pdf?src-supplier=Ciiva; ComponentLink4Description: https://datasheet.octopart.com:443/GRM21BR61H106KE43L-Murata-datasheet-140707579.pdf?src-supplier=Ciiva; ComponentLink5URL: https://datasheet.octopart.com:443/GRM21BR61H106KE43L-Murata-datasheet-138744880.pdf?src-supplier=Ciiva; ComponentLink5Description: https://datasheet.octopart.com:443/GRM21BR61H106KE43L-Murata-datasheet-138744880.pdf?src-supplier=Ciiva; ComponentLink6URL: https://datasheet.octopart.com/GRM21BR61H106KE43L-Murata-datasheet-12515295.pdf; ComponentLink6Description: https://datasheet.octopart.com/GRM21BR61H106KE43L-Murata-datasheet-12515295.pdf; ComponentLink7URL: https://datasheet.octopart.com/GRM21BR61H106KE43L-Murata-datasheet-12510076.pdf; ComponentLink7Description: https://datasheet.octopart.com/GRM21BR61H106KE43L-Murata-datasheet-12510076.pdf; ComponentLink8URL: https://datasheet.octopart.com/GRM21BR61H106KE43L-Murata-datasheet-11978611.pdf; ComponentLink8Description: https://datasheet.octopart.com/GRM21BR61H106KE43L-Murata-datasheet-11978611.pdf; ComponentLink9URL: https://datasheet.octopart.com/GRM21BR61H106KE43L-Murata-datasheet-10025737.pdf; ComponentLink9Description: https://datasheet.octopart.com/GRM21BR61H106KE43L-Murata-datasheet-10025737.pdf; ComponentLink10URL: https://datasheet.octopart.com/GRM21BR61H106KE43L-Murata-datasheet-8819587.pdf; ComponentLink10Description: https://datasheet.octopart.com/GRM21BR61H106KE43L-Murata-datasheet-8819587.pdf; ComponentLink11URL: http://sigma.octopart.com:80/reach_statement/Murata-company-16.pdf?src-supplier=Compliance+Statements; ComponentLink11Description: http://sigma.octopart.com:80/reach_statement/Murata-company-16.pdf?src-supplier=Compliance+Statements; JLCPCB Part Number: C440198
C18 C25 = PE105J2A0502: -40℃~+110℃ 100V 1uF Metallized Polyester ±5% Plugin,P=5mm Film Capacitors ROHS; JLCPCB Part Number: C390070; Value: 1uF
C19 C28 = CC0603FRNPO9BN100: 50V 10pF NP0 ±1% 0603 Multilayer Ceramic Capacitors MLCC - SMD/SMT ROHS; Manufacturer: Yageo Group; Dielectric: C0G; Temperature Coefficient: 30ppm/°C; Supplier: Newark; Supplier Part Number: CC0603FRNPO9BN100; Manufacturer Part Number: CC0603FRNPO9BN100; RoHS: Compliant; Category: Ceramic Capacitors; Stock: 69258; Pricing: 10=0.073, 11=0.0481, 20=0.072, 30=0.071, 50=0.069, 100=0.068, 101=0.0348, 250=0.055, 500=0.042, 501=0.03, 1000=0.038, 1001=0.0264 (USD); Value: 10pF; Case/Package: 0603; Case Code (Imperial): 0603; Case Code (Metric): 1608; China RoHS: Compliant; Composition: Ceramic; Depth: 800µm; Dielectric Material: Ceramic; Dissipation Factor: 1%; Halogen Free: Halogen Free; Height: 800µm; Lead Free: Lead Free; Length: 1.6mm; Lifecycle Status: Production; Max Operating Temperature: 125°C; Min Operating Temperature: -55°C; Mounting Technology: Surface Mount; Pins: 2; Number of Terminals: 2; Packaging: Tape and Reel; Radiation Hardening: No; REACH SVHC: Unaffected; Schedule B: 8532240020, 8532240020|8532240020|8532240020|8532240020|8532240020; Termination: SMD/SMT; Thickness: 889µm; Tolerance: 1%; Voltage Rating: 50V; Voltage Rating (DC): 50V; Width: 800µm; ComponentLink1URL: https://datasheet.octopart.com:443/CC0603FRNPO9BN100-Yageo-datasheet-182140217.pdf?src-supplier=IHS; ComponentLink1Description: https://datasheet.octopart.com:443/CC0603FRNPO9BN100-Yageo-datasheet-182140217.pdf?src-supplier=IHS; ComponentLink2URL: https://datasheet.octopart.com:443/CC0603FRNPO9BN100-Yageo-datasheet-151948684.pdf?src-supplier=element14+APAC; ComponentLink2Description: https://datasheet.octopart.com:443/CC0603FRNPO9BN100-Yageo-datasheet-151948684.pdf?src-supplier=element14+APAC; ComponentLink3URL: https://datasheet.octopart.com:443/CC0603FRNPO9BN100-Yageo-datasheet-65873193.pdf?src-supplier=element14+APAC; ComponentLink3Description: https://datasheet.octopart.com:443/CC0603FRNPO9BN100-Yageo-datasheet-65873193.pdf?src-supplier=element14+APAC; ComponentLink4URL: https://datasheet.octopart.com:443/CC0603FRNPO9BN100-Yageo-datasheet-10406438.pdf?src-supplier=Newark; ComponentLink4Description: https://datasheet.octopart.com:443/CC0603FRNPO9BN100-Yageo-datasheet-10406438.pdf?src-supplier=Newark; ComponentLink5URL: https://datasheet.octopart.com:443/CC0603FRNPO9BN100-Yageo-datasheet-181967871.pdf?src-supplier=Farnell; ComponentLink5Description: https://datasheet.octopart.com:443/CC0603FRNPO9BN100-Yageo-datasheet-181967871.pdf?src-supplier=Farnell; ComponentLink6URL: https://datasheet.octopart.com:443/CC0603FRNPO9BN100-Yageo-Group-datasheet-188689597.pdf?src-supplier=Farnell; ComponentLink6Description: https://datasheet.octopart.com:443/CC0603FRNPO9BN100-Yageo-Group-datasheet-188689597.pdf?src-supplier=Farnell; ComponentLink7URL: https://datasheet.octopart.com:443/CC0603FRNPO9BN100-Yageo-Group-datasheet-188129580.pdf?src-supplier=LCSC; ComponentLink7Description: https://datasheet.octopart.com:443/CC0603FRNPO9BN100-Yageo-Group-datasheet-188129580.pdf?src-supplier=LCSC; ComponentLink8URL: https://datasheet.octopart.com:443/CC0603FRNPO9BN100-Yageo-datasheet-137875056.pdf?src-supplier=Future+Electronics; ComponentLink8Description: https://datasheet.octopart.com:443/CC0603FRNPO9BN100-Yageo-datasheet-137875056.pdf?src-supplier=Future+Electronics; ComponentLink9URL: https://datasheet.octopart.com:443/CC0603FRNPO9BN100-Yageo-datasheet-136957424.pdf?src-supplier=Future+Electronics; ComponentLink9Description: https://datasheet.octopart.com:443/CC0603FRNPO9BN100-Yageo-datasheet-136957424.pdf?src-supplier=Future+Electronics; ComponentLink10URL: https://datasheet.octopart.com:443/CC0603FRNPO9BN100-Yageo-datasheet-137700082.pdf?src-supplier=Future+Electronics; ComponentLink10Description: https://datasheet.octopart.com:443/CC0603FRNPO9BN100-Yageo-datasheet-137700082.pdf?src-supplier=Future+Electronics; ComponentLink11URL: https://datasheet.octopart.com:443/CC0603FRNPO9BN100-Yageo-datasheet-78855684.pdf?src-supplier=Future+Electronics; ComponentLink11Description: https://datasheet.octopart.com:443/CC0603FRNPO9BN100-Yageo-datasheet-78855684.pdf?src-supplier=Future+Electronics; ComponentLink12URL: https://datasheet.octopart.com:443/CC0603FRNPO9BN100-Yageo-datasheet-16730043.pdf?src-supplier=Future+Electronics; ComponentLink12Description: https://datasheet.octopart.com:443/CC0603FRNPO9BN100-Yageo-datasheet-16730043.pdf?src-supplier=Future+Electronics; ComponentLink13URL: https://datasheet.octopart.com:443/CC0603FRNPO9BN100-Yageo-datasheet-15895757.pdf?src-supplier=Future+Electronics; ComponentLink13Description: https://datasheet.octopart.com:443/CC0603FRNPO9BN100-Yageo-datasheet-15895757.pdf?src-supplier=Future+Electronics; ComponentLink14URL: https://datasheet.octopart.com:443/CC0603FRNPO9BN100-Yageo-datasheet-12589826.pdf?src-supplier=Future+Electronics; ComponentLink14Description: https://datasheet.octopart.com:443/CC0603FRNPO9BN100-Yageo-datasheet-12589826.pdf?src-supplier=Future+Electronics; ComponentLink15URL: http://sigma.octopart.com:80/conflict_mineral_statement/Yageo-company-3.pdf?src-supplier=Compliance+Statements; ComponentLink15Description: http://sigma.octopart.com:80/conflict_mineral_statement/Yageo-company-3.pdf?src-supplier=Compliance+Statements; ComponentLink16URL: http://sigma.octopart.com:80/rohs_statement/Yageo-company-2.pdf?src-supplier=Compliance+Statements; ComponentLink16Description: http://sigma.octopart.com:80/rohs_statement/Yageo-company-2.pdf?src-supplier=Compliance+Statements; JLCPCB Part Number: C309467
C22 = RVT1E101M0607: Capacitor Polarised; Manufacturer_Name: ROQANG; Datasheet Link: https://jlcpcb.com/partdetail/ROQANG-RVT1E101M0607/C72477; Height: 8mm; Manufacturer_Part_Number: RVT1E101M0607; JLCPCB Part Number: C72477; Value: 100uF
C26 = CC0603CRNPO9BN4R7: Surface Mount Ceramic Multilayer Capacitor 4.7pF 0.25pF C0G 50V 0603 Paper T/R; Manufacturer: Yageo Group; Insulation Resistance: 100GΩ; Temperature Coefficient: 30ppm/°C; Supplier: Avnet; Supplier Part Number: CC0603CRNPO9BN4R7; Manufacturer Part Number: CC0603CRNPO9BN4R7; RoHS: Compliant; Category: Ceramic Capacitors; Stock: 4000; Pricing: 4000=0.00724 (USD); Value: 4.7pF; Case/Package: 0603; Case Code (Imperial): 0603; Case Code (Metric): 1608; China RoHS: Compliant; Composition: Ceramic; Country of Origin: Mainland China, Taiwan; Depth: 800µm; Dielectric: C0G; Dielectric Material: Ceramic; Export Control Classification Number (ECCN) Code: EAR99; Halogen Free: Halogen Free; Height: 800µm; Harmonized Tariff Schedule (HTS) Code: 8532.24.00.20; Introduction Date: 2009-04-16; Lead Free: Lead Free; Length: 1.6mm; Lifecycle Status: Production; Max Operating Temperature: 125°C; Min Operating Temperature: -55°C; Mounting Technology: Surface Mount; Pins: 2; Number of Terminals: 2; Packaging: Cut Tape; Radiation Hardening: No; REACH SVHC: Unaffected; Schedule B: 8532240020, 8532240020|8532240020, 8532240020|8532240020|8532240020, 8532240020|8532240020|8532240020|8532240020; Termination: SMD/SMT; Thickness: 889µm; Voltage: 50V; Voltage Rating: 50V; Voltage Rating (AC): 50V; Voltage Rating (DC): 50V; Weight: 2.012816mg; Width: 800µm; ComponentLink1URL: https://datasheet.octopart.com:443/CC0603CRNPO9BN4R7-Yageo-datasheet-182140217.pdf?src-supplier=IHS; ComponentLink1Description: https://datasheet.octopart.com:443/CC0603CRNPO9BN4R7-Yageo-datasheet-182140217.pdf?src-supplier=IHS; ComponentLink2URL: https://datasheet.octopart.com:443/CC0603CRNPO9BN4R7-Yageo-Group-datasheet-192360829.pdf?src-supplier=Future+Electronics; ComponentLink2Description: https://datasheet.octopart.com:443/CC0603CRNPO9BN4R7-Yageo-Group-datasheet-192360829.pdf?src-supplier=Future+Electronics; ComponentLink3URL: https://datasheet.octopart.com:443/CC0603CRNPO9BN4R7-Yageo-datasheet-5321569.pdf?src-supplier=Future+Electronics; ComponentLink3Description: https://datasheet.octopart.com:443/CC0603CRNPO9BN4R7-Yageo-datasheet-5321569.pdf?src-supplier=Future+Electronics; ComponentLink4URL: https://datasheet.octopart.com:443/CC0603CRNPO9BN4R7-Yageo-datasheet-137875056.pdf?src-supplier=Future+Electronics; ComponentLink4Description: https://datasheet.octopart.com:443/CC0603CRNPO9BN4R7-Yageo-datasheet-137875056.pdf?src-supplier=Future+Electronics; ComponentLink5URL: https://datasheet.octopart.com:443/CC0603CRNPO9BN4R7-Yageo-datasheet-136957424.pdf?src-supplier=Future+Electronics; ComponentLink5Description: https://datasheet.octopart.com:443/CC0603CRNPO9BN4R7-Yageo-datasheet-136957424.pdf?src-supplier=Future+Electronics; ComponentLink6URL: https://datasheet.octopart.com:443/CC0603CRNPO9BN4R7-Yageo-datasheet-137700082.pdf?src-supplier=Future+Electronics; ComponentLink6Description: https://datasheet.octopart.com:443/CC0603CRNPO9BN4R7-Yageo-datasheet-137700082.pdf?src-supplier=Future+Electronics; ComponentLink7URL: https://datasheet.octopart.com:443/CC0603CRNPO9BN4R7-Yageo-datasheet-78855684.pdf?src-supplier=Future+Electronics; ComponentLink7Description: https://datasheet.octopart.com:443/CC0603CRNPO9BN4R7-Yageo-datasheet-78855684.pdf?src-supplier=Future+Electronics; ComponentLink8URL: https://datasheet.octopart.com:443/CC0603CRNPO9BN4R7-Yageo-datasheet-62091628.pdf?src-supplier=Future+Electronics; ComponentLink8Description: https://datasheet.octopart.com:443/CC0603CRNPO9BN4R7-Yageo-datasheet-62091628.pdf?src-supplier=Future+Electronics; ComponentLink9URL: https://datasheet.octopart.com:443/CC0603CRNPO9BN4R7-Yageo-datasheet-24578986.pdf?src-supplier=Future+Electronics; ComponentLink9Description: https://datasheet.octopart.com:443/CC0603CRNPO9BN4R7-Yageo-datasheet-24578986.pdf?src-supplier=Future+Electronics; ComponentLink10URL: https://datasheet.octopart.com:443/CC0603CRNPO9BN4R7-Yageo-datasheet-16730043.pdf?src-supplier=Future+Electronics; ComponentLink10Description: https://datasheet.octopart.com:443/CC0603CRNPO9BN4R7-Yageo-datasheet-16730043.pdf?src-supplier=Future+Electronics; ComponentLink11URL: https://datasheet.octopart.com:443/CC0603CRNPO9BN4R7-Yageo-datasheet-15895757.pdf?src-supplier=Future+Electronics; ComponentLink11Description: https://datasheet.octopart.com:443/CC0603CRNPO9BN4R7-Yageo-datasheet-15895757.pdf?src-supplier=Future+Electronics; ComponentLink12URL: https://datasheet.octopart.com:443/CC0603CRNPO9BN4R7-Yageo-datasheet-12589826.pdf?src-supplier=Future+Electronics; ComponentLink12Description: https://datasheet.octopart.com:443/CC0603CRNPO9BN4R7-Yageo-datasheet-12589826.pdf?src-supplier=Future+Electronics; ComponentLink13URL: https://datasheet.octopart.com:443/CC0603CRNPO9BN4R7-Yageo-datasheet-8817079.pdf?src-supplier=Future+Electronics; ComponentLink13Description: https://datasheet.octopart.com:443/CC0603CRNPO9BN4R7-Yageo-datasheet-8817079.pdf?src-supplier=Future+Electronics; ComponentLink14URL: https://datasheet.octopart.com:443/CC0603CRNPO9BN4R7-Yageo-datasheet-8324240.pdf?src-supplier=Future+Electronics; ComponentLink14Description: https://datasheet.octopart.com:443/CC0603CRNPO9BN4R7-Yageo-datasheet-8324240.pdf?src-supplier=Future+Electronics; ComponentLink15URL: https://datasheet.octopart.com:443/CC0603CRNPO9BN4R7-Yageo-datasheet-504625.pdf?src-supplier=Future+Electronics; ComponentLink15Description: https://datasheet.octopart.com:443/CC0603CRNPO9BN4R7-Yageo-datasheet-504625.pdf?src-supplier=Future+Electronics; ComponentLink16URL: https://datasheet.octopart.com:443/CC0603CRNPO9BN4R7-Yageo-datasheet-10406438.pdf?src-supplier=element14+APAC; ComponentLink16Description: https://datasheet.octopart.com:443/CC0603CRNPO9BN4R7-Yageo-datasheet-10406438.pdf?src-supplier=element14+APAC; ComponentLink17URL: https://datasheet.octopart.com:443/CC0603CRNPO9BN4R7-Yageo-datasheet-65873193.pdf?src-supplier=element14+APAC; ComponentLink17Description: https://datasheet.octopart.com:443/CC0603CRNPO9BN4R7-Yageo-datasheet-65873193.pdf?src-supplier=element14+APAC; ComponentLink18URL: https://datasheet.octopart.com:443/CC0603CRNPO9BN4R7-Yageo-datasheet-181967803.pdf?src-supplier=Newark; ComponentLink18Description: https://datasheet.octopart.com:443/CC0603CRNPO9BN4R7-Yageo-datasheet-181967803.pdf?src-supplier=Newark; ComponentLink19URL: https://datasheet.octopart.com:443/CC0603CRNPO9BN4R7-Yageo-datasheet-151948684.pdf?src-supplier=Newark; ComponentLink19Description: https://datasheet.octopart.com:443/CC0603CRNPO9BN4R7-Yageo-datasheet-151948684.pdf?src-supplier=Newark; ComponentLink20URL: https://datasheet.octopart.com:443/CC0603CRNPO9BN4R7-Yageo-datasheet-67645495.pdf?src-supplier=Newark; ComponentLink20Description: https://datasheet.octopart.com:443/CC0603CRNPO9BN4R7-Yageo-datasheet-67645495.pdf?src-supplier=Newark; ComponentLink21URL: https://datasheet.octopart.com:443/CC0603CRNPO9BN4R7-Yageo-Group-datasheet-188129580.pdf?src-supplier=LCSC; ComponentLink21Description: https://datasheet.octopart.com:443/CC0603CRNPO9BN4R7-Yageo-Group-datasheet-188129580.pdf?src-supplier=LCSC; ComponentLink22URL: https://datasheet.octopart.com:443/CC0603CRNPO9BN4R7-Yageo-datasheet-10621397.pdf?src-supplier=Farnell; ComponentLink22Description: https://datasheet.octopart.com:443/CC0603CRNPO9BN4R7-Yageo-datasheet-10621397.pdf?src-supplier=Farnell; ComponentLink23URL: https://datasheet.octopart.com:443/CC0603CRNPO9BN4R7-Yageo-datasheet-8643175.pdf?src-supplier=SOS+electronic; ComponentLink23Description: https://datasheet.octopart.com:443/CC0603CRNPO9BN4R7-Yageo-datasheet-8643175.pdf?src-supplier=SOS+electronic; ComponentLink24URL: http://sigma.octopart.com:80/conflict_mineral_statement/Yageo-company-3.pdf?src-supplier=Compliance+Statements; ComponentLink24Description: http://sigma.octopart.com:80/conflict_mineral_statement/Yageo-company-3.pdf?src-supplier=Compliance+Statements; ComponentLink25URL: http://sigma.octopart.com:80/rohs_statement/Yageo-company-2.pdf?src-supplier=Compliance+Statements; ComponentLink25Description: http://sigma.octopart.com:80/rohs_statement/Yageo-company-2.pdf?src-supplier=Compliance+Statements; JLCPCB Part Number: C282071